# EAGLE design MSEDualAmp (EAGLE 5.11)
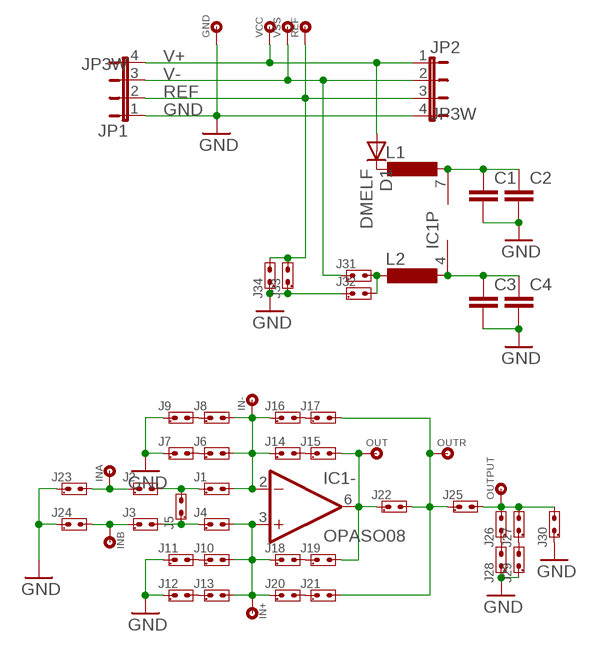
[diagram p0: schematic, sheet 1]

## Parts
C1  C1206  [C1206]
C2  C1206  [C1206]
C3  C1206  [C1206]
C4  C1206  [C1206]
D1  DMELF  [MELF-MLL41]
GND  TP  [JP1]
IC1  OPASO08  [SO08]
IN+  TP  [JP1]
IN-  TP  [JP1]
INA  TP  [JP1]
INB  TP  [JP1]
J1  JP  [JP2]
J2  JP  [JP2]
J3  JP  [JP2]
J4  JP  [JP2]
J5  JP  [JP2]
J6  JP  [JP2]
J7  JP  [JP2]
J8  JP  [JP2]
J9  JP  [JP2]
J10  JP  [JP2]
J11  JP  [JP2]
J12  JP  [JP2]
J13  JP  [JP2]
J14  JP  [JP2]
J15  JP  [JP2]
J16  JP  [JP2]
J17  JP  [JP2]
J18  JP  [JP2]
J19  JP  [JP2]
J20  JP  [JP2]
J21  JP  [JP2]
J22  JP  [JP2]
J23  JP  [JP2]
J24  JP  [JP2]
J25  JP  [JP2]
J26  JP  [JP2]
J27  JP  [JP2]
J28  JP  [JP2]
J29  JP  [JP2]
J30  JP  [JP2]
J31  JP  [JP2]
J32  JP  [JP2]
J33  JP  [JP2]
J34  JP  [JP2]
JP1  JP3W  [JP2W]
JP2  JP3W  [JP2W]
L1  L0805  [R0805]
L2  L0805  [R0805]
OUT  TP  [JP1]
OUTPUT  TP  [JP1]
OUTR  TP  [JP1]
REF  TP  [JP1]
VCC  TP  [JP1]
VSS  TP  [JP1]

## Nets
GND: C1.1 C2.1 C3.1 C4.1 GND.1 J7.1 J9.1 J11.1 J12.1 J23.1 J24.1 J28.1 J29.1 J30.1 J32.1 J33.1 J34.1 JP1.1 JP2.4
N$1: J6.1 J7.2
N$2: J8.1 J9.2
N$3: J10.1 J11.2
N$4: J12.2 J13.1
N$5: J14.2 J15.1
N$6: J16.2 J17.1
N$7: J18.2 J19.1
N$8: J20.2 J21.1
N$9: IC1.6(-:OUT) J15.2 J19.2 J22.1 OUT.1
N$10: IC1.2(-:-IN) IN-.1 J1.2 J6.2 J8.2 J14.1 J16.1
N$11: IC1.3(-:+IN) IN+.1 J4.2 J10.2 J13.2 J18.1 J20.1
N$12: J1.1 J2.2 J5.2
N$13: J3.2 J4.1 J5.1
N$14: J17.2 J21.2 J22.2 J25.1 OUTR.1
N$15: INA.1 J2.1 J23.2
N$16: INB.1 J3.1 J24.2
N$17: J26.1 J28.2
N$18: J27.1 J29.2
N$19: J25.2 J26.2 J27.2 J30.2 OUTPUT.1
N$20: C3.2 C4.2 IC1.4(P:V-) L2.2
N$26: C1.2 C2.2 IC1.7(P:V+) L1.2
N$27: J31.2 J32.2 L2.1
N$28: D1.C L1.1
REF: J33.2 J34.2 JP1.2 JP2.3 REF.1
V+: D1.A JP1.4 JP2.1 VCC.1
V-: J31.1 JP1.3 JP2.2 VSS.1

## Library data of the parts
C1-C4 = MRobi:C: Capacitor
D1 = NoiseTR:D: Diode
GND IN+ IN- INA INB OUT OUTPUT OUTR REF VCC VSS = MRobi:TP: Test Pin
IC1 = MRobi:OPA: Single OP-Amp
J1-J34 = MRobi:JP
JP1 JP2 = Zoli2:JP3W
L1 L2 = NoiseRLC:L: Inductance

## Board
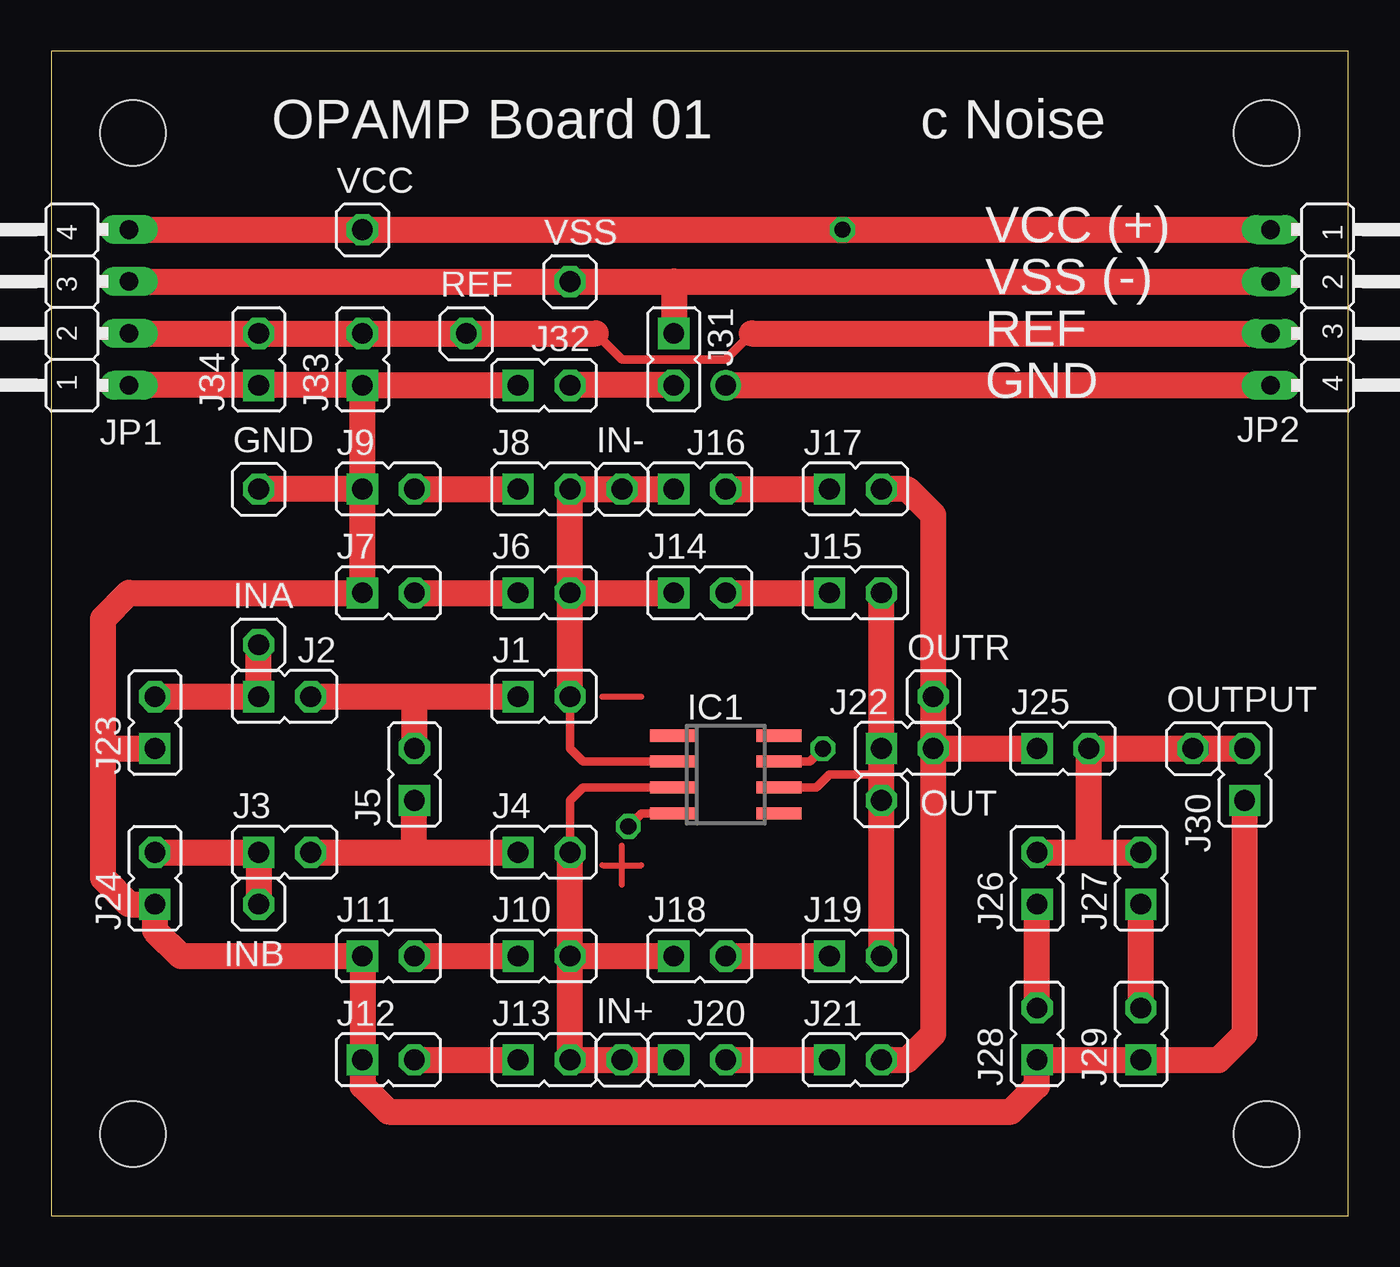
[diagram p1: board, top side]
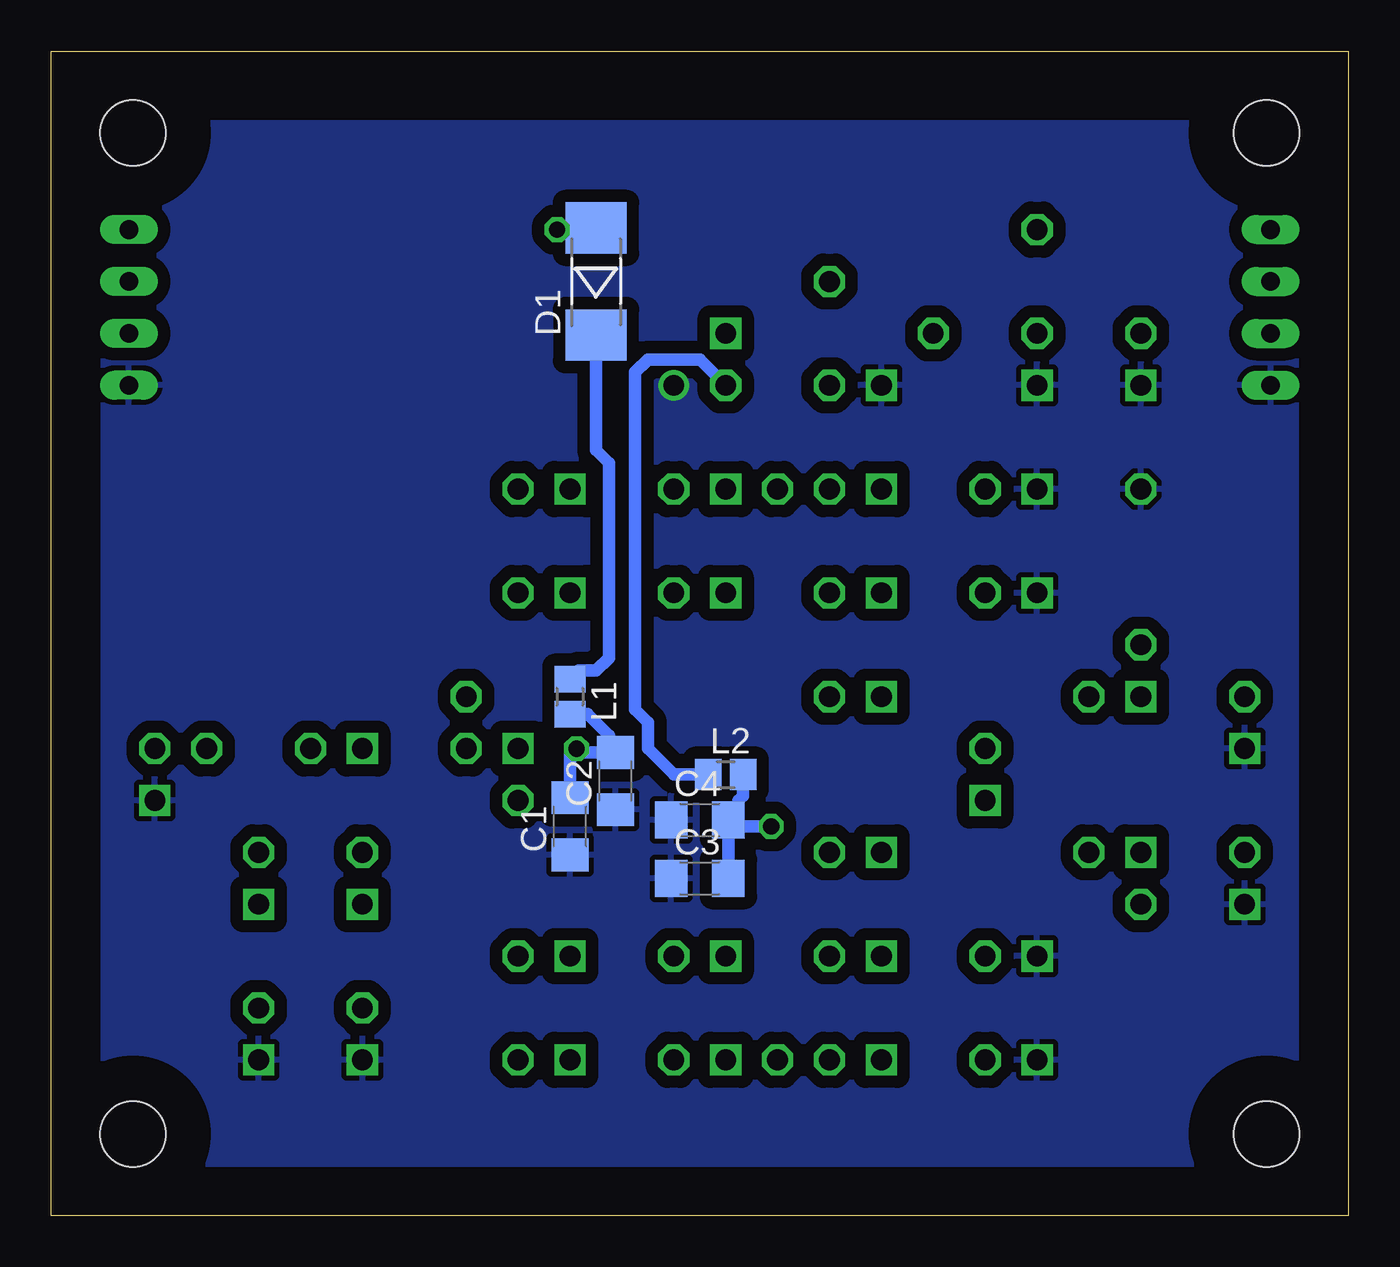
[diagram p2: board, bottom side, seen from below]

Size 63.5 x 57 mm. Coordinates in mm from the lower left corner, seen from the top.
Outline: 0,0 63.5,0 63.5,57 0,57 0,0
Copper layers (1*16): Top 0.035mm / dielectric 1.5mm / Bottom 0.035mm
Design rules "default": minimum track width 10mil, minimum drill 24mil, track to track 8mil, track to pad 8mil, pad to pad 8mil, via to via 8mil, smd to smd 8mil, copper to edge 40mil, drill to drill 8mil, minimum pad ring 10mil, minimum via ring 8mil, stop-mask expansion 4mil, vias tented up to drill 0mil, thermal gap 10mil
Holes 3.2 mm at 4,4 59.5,4 4,53 59.5,53
bRestrict: area 1,50 to 7,56; area 56.5,50 to 62.5,56; area 56.5,1 to 62.5,7; area 1,1 to 7,7

### Footprints (pad centres in the part's own frame; a part is rotated, then mirrored left to right if it is on the bottom)
C1206 = smd 1.6 x 1.8: 1 -1.4,0; 2 1.4,0
MELF-MLL41 = smd 2.5 x 3: A 2.625,0; C -2.625,0
JP1 = drill 1.016 octagon: 1 0,0
SO08 = smd 0.6 x 2.2: 1 -1.905,-2.6; 2 -0.635,-2.6; 3 0.635,-2.6; 4 1.905,-2.6; 5 1.905,2.6; 6 0.635,2.6; 7 -0.635,2.6; 8 -1.905,2.6
JP2 = drill 1.016 pad 1.524 square: 1 -1.27,0 | drill 1.016 pad 1.524 octagon: 2 1.27,0
JP2W = drill 0.914 long: 1 -2.54,-1.27; 2 0,-1.27; 3 2.54,-1.27; 4 5.08,-1.27
R0805 = smd 1.3 x 1.5: 1 -0.85,0; 2 0.85,0

### Placement (x,y rotation side)
C1  38.1,19.05 90 bottom
C2  35.88,21.27 90 bottom
C3  31.75,16.51 0 bottom
C4  31.75,19.37 0 bottom
D1  36.83,45.72 90 bottom
GND  10.16,35.56 0 top
IC1  33.02,21.59 270 top
IN+  27.94,7.62 0 top
IN-  27.94,35.56 0 top
INA  10.16,27.94 0 top
INB  10.16,15.24 180 top
J1  24.13,25.4 0 top
J2  11.43,25.4 0 top
J3  11.43,17.78 0 top
J4  24.13,17.78 0 top
J5  17.78,21.59 90 top
J6  24.13,30.48 0 top
J7  16.51,30.48 0 top
J8  24.13,35.56 0 top
J9  16.51,35.56 0 top
J10  24.13,12.7 0 top
J11  16.51,12.7 0 top
J12  16.51,7.62 0 top
J13  24.13,7.62 0 top
J14  31.75,30.48 0 top
J15  39.37,30.48 0 top
J16  31.75,35.56 0 top
J17  39.37,35.56 0 top
J18  31.75,12.7 0 top
J19  39.37,12.7 0 top
J20  31.75,7.62 0 top
J21  39.37,7.62 0 top
J22  41.91,22.86 0 top
J23  5.08,24.13 90 top
J24  5.08,16.51 90 top
J25  49.53,22.86 0 top
J26  48.26,16.51 90 top
J27  53.34,16.51 90 top
J28  48.26,8.89 90 top
J29  53.34,8.89 90 top
J30  58.42,21.59 90 top
J31  30.48,41.91 270 top
J32  24.13,40.64 0 top
J33  15.24,41.91 90 top
J34  10.16,41.91 90 top
JP1  2.54,43.18 90 top
JP2  60.96,45.72 270 top
L1  38.1,25.4 270 bottom
L2  30.48,21.59 0 bottom
OUT  40.64,20.32 0 top
OUTPUT  55.88,22.86 0 top
OUTR  43.18,25.4 0 top
REF  20.32,43.18 0 top
VCC  15.24,48.26 0 top
VSS  25.4,45.72 0 top

### Tracks (layer width: path | path; a pad name or v marks a point on that pad's centre or on a via)
GND  (via drill 1)
  Top 1.27: J33.1 J34.1 JP1.1 | J9.1 J33.1 | J9.1 J7.1 3.81,30.48 2.54,29.21 2.54,22.86 | J33.1 J32.1 | J9.1 GND.1 | J30.1 58.42,8.89 57.15,7.62 J29.1 J28.1 48.26,6.35 46.99,5.08 16.51,5.08 15.24,6.35 J12.1 J11.1 6.35,12.7 5.08,13.97 J24.1 3.81,15.24 2.54,16.51 2.54,22.86 | 2.54,22.86 J23.1 | v33.02,40.64 JP2.4
  pour Bottom (isolate 0.61): 2.54,53.46 60.96,53.46 60.96,2.54 2.54,2.54
N$1
  Top 1.27: J7.2 J6.1
N$2
  Top 1.27: J9.2 J8.1
N$3
  Top 1.27: J11.2 J10.1
N$4
  Top 1.27: J12.2 J13.1
N$5
  Top 1.27: J14.2 J15.1
N$6
  Top 1.27: J16.2 J17.1
N$7
  Top 1.27: J18.2 J19.1
N$8
  Top 1.27: J20.2 J21.1
N$9
  Top 0.406: IC1.6 37.47,20.95 38.1,21.59 40.64,21.59
  Top 1.27: J22.1 J15.2 | J19.2 OUT.1 | OUT.1 40.64,21.59 J22.1 | OUT.1 J22.1
N$10
  Top 0.406: IC1.2 26.04,22.23 25.4,22.86 J1.2
  Top 1.27: J1.2 J6.2 | J6.2 J14.1 | J6.2 J8.2 IN-.1 29.84,35.56 J16.1
N$11
  Top 0.406: IC1.3 26.04,20.95 25.4,20.32 J4.2
  Top 1.27: J10.2 J4.2 | J10.2 J18.1 | J10.2 J13.2 IN+.1 J20.1
N$12
  Top 1.27: J2.2 17.78,25.4 | 17.78,25.4 J5.2 | 17.78,25.4 J1.1
N$13
  Top 1.27: J3.2 17.78,17.78 | 17.78,17.78 J5.1 | 17.78,17.78 J4.1
N$14
  Top 1.27: J17.2 41.91,35.56 43.18,34.29 OUTR.1 J22.2 | J21.2 41.91,7.62 43.18,8.89 J22.2 | J22.2 J25.1
N$15
  Top 1.27: J23.2 J2.1 INA.1
N$16
  Top 1.27: J24.2 J3.1 INB.1
N$17
  Top 1.27: J28.2 J26.1
N$18
  Top 1.27: J29.2 J27.1
N$19
  Top 1.27: 50.8,17.78 J25.2 OUTPUT.1 J30.2 | J26.2 50.8,17.78 | 50.8,17.78 J27.2
N$20  (via drill 0.8)
  Top 0.406: IC1.4 28.89,19.68 v28.26,19.05
  Bottom 0.61: C3.2 C4.2 30.03,19.05 29.84,19.05 | L2.2 29.63,20.54 29.84,20.32 29.84,19.05 | 29.84,19.05 v28.26,19.05
N$23
  Top 0.305: 26.99,25.4 28.89,25.4
N$24
  Top 0.305: 26.99,17.14 28.89,17.14
N$25
  Top 0.305: 27.94,16.19 27.94,18.1
N$26  (via drill 0.8)
  Top 0.406: IC1.7 37.15,22.23 v37.78,22.86
  Bottom 0.406: v37.78,22.86 37.59,22.86
  Bottom 0.61: L1.2 37.25,24.55 36.2,23.5 36.2,22.99 C2.2 37.59,22.67 v37.78,22.86 38.1,22.54 C1.2
N$27
  Top 1.27: J31.2 J32.2
  Bottom 0.61: L2.1 33.02,21.59 34.29,22.86 34.29,24.13 34.92,24.77 34.92,41.27 34.29,41.91 31.75,41.91 J31.2
N$28
  Bottom 0.61: D1.C 36.83,37.47 36.2,36.83 36.2,27.3 36.83,26.67 37.68,26.67 L1.1
REF
  Top 0.406: 26.67,43.18 27.94,41.91 33.02,41.91 34.29,43.18
  Top 1.27: 26.67,43.18 REF.1 J33.2 J34.2 JP1.2 | 34.29,43.18 JP2.3
V+  (via drill 0.8)
  Top 1.27: JP1.4 VCC.1 v38.73,48.26 JP2.1
  Bottom 0.406: D1.A 38.65,48.34 v38.73,48.26
V-
  Top 1.27: 30.48,45.72 VSS.1 JP1.3 | 30.48,45.72 J31.1 | 30.48,45.72 JP2.2

### Text on the board
tNames: OPAMP Board 01 | c Noise | VCC (+) | VSS (-) | REF | GND